# EAGLE design breakout (EAGLE 4.16)
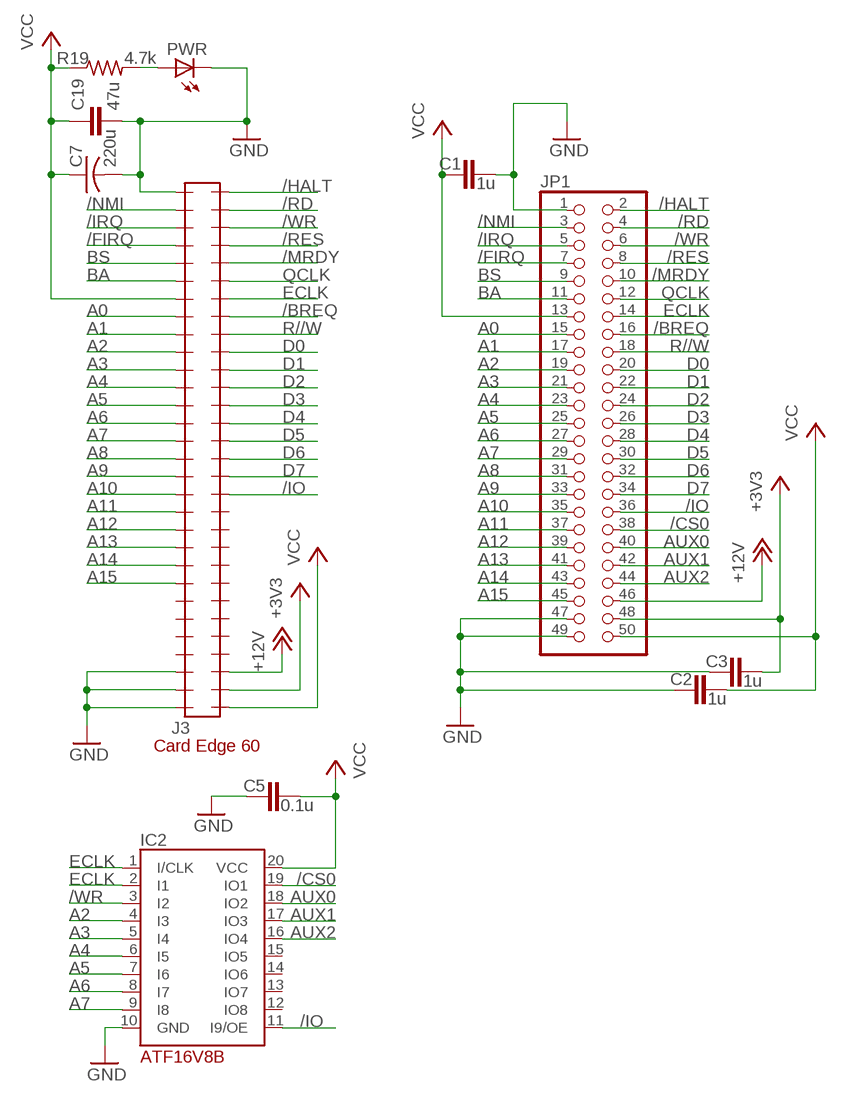
[diagram p0: schematic, sheet 1]

## Parts
C1  1u  C-EUC0603  [C0603]
C2  1u  C-EUC0603  [C0603]
C3  1u  C-EUC0603  [C0603]
C5  0.1u  C-EUC0603  [C0603]
C7  220u  C-US025-050X050  [C025-050X050]
C19  47u  C-EUC0805  [C0805]
IC2  PLD_ATF16V8B  [DIL20]
J3  CARDEDGE_2.54_60POSEDGE  [CARDEDGE_2.54_60POS]
JP1  PINHD-2X25  [2X25]
PWR  LED3MM  [LED3MM]
R19  4.7k  R-US_R0603  [R0603]

## Nets
+3V3 [supply]: C3.2 J3.32 JP1.48
+12V [supply]: J3.33 JP1.46
/BREQ: J3.53 JP1.16
/CS0: IC2.19(IO1) JP1.38
/FIRQ: J3.4 JP1.7
/HALT: J3.60 JP1.2
/IO: IC2.11(I9/OE) J3.43 JP1.36
/IRQ: J3.3 JP1.5
/MRDY: J3.56 JP1.10
/NMI: J3.2 JP1.3
/RD: J3.59 JP1.4
/RES: J3.57 JP1.8
/WR: IC2.3(I2) J3.58 JP1.6
A0: J3.8 JP1.15
A1: J3.9 JP1.17
A2: IC2.4(I3) J3.10 JP1.19
A3: IC2.5(I4) J3.11 JP1.21
A4: IC2.6(I5) J3.12 JP1.23
A5: IC2.7(I6) J3.13 JP1.25
A6: IC2.8(I7) J3.14 JP1.27
A7: IC2.9(I8) J3.15 JP1.29
A8: J3.16 JP1.31
A9: J3.17 JP1.33
A10: J3.18 JP1.35
A11: J3.19 JP1.37
A12: J3.20 JP1.39
A13: J3.21 JP1.41
A14: J3.22 JP1.43
A15: J3.23 JP1.45
AUX0: IC2.18(IO2) JP1.40
AUX1: IC2.17(IO3) JP1.42
AUX2: IC2.16(IO4) JP1.44
BA: J3.6 JP1.11
BS: J3.5 JP1.9
D0: J3.51 JP1.20
D1: J3.50 JP1.22
D2: J3.49 JP1.24
D3: J3.48 JP1.26
D4: J3.47 JP1.28
D5: J3.46 JP1.30
D6: J3.45 JP1.32
D7: J3.44 JP1.34
ECLK: IC2.1(I/CLK) IC2.2(I1) J3.54 JP1.14
GND: C1.2 C2.1 C3.1 C5.1 C7.2 C19.2 IC2.10(GND) J3.1 J3.28 J3.29 J3.30 JP1.1 JP1.47 JP1.49 PWR.K(C)
N$23: PWR.A R19.2
QCLK: J3.55 JP1.12
R//W: J3.52 JP1.18
VCC [supply]: C1.1 C2.2 C5.2 C7.1 C19.1 IC2.20(VCC) J3.7 J3.31 JP1.13 JP1.50 R19.1
Unconnected: IC2.12(IO8) IC2.13(IO7) IC2.14(IO6) IC2.15(IO5) J3.24 J3.25 J3.26 J3.27 J3.34 J3.35 J3.36 J3.37 J3.38 J3.39 J3.40 J3.41 J3.42

## Library data of the parts
C1-C3 C5 C19 = rcl:C-EU: CAPACITOR, European symbol
C7 = rcl:C-US: CAPACITOR, American symbol
IC2 = 07-Retrocomputing:PLD_ATF16V8B
J3 = 07-Retrocomputing:CARDEDGE_2.54_60POS
JP1 = pinhead:PINHD-2X25: PIN HEADER
PWR = led:LED: LED OSRAM: - CHIPLED LG R971, LG N971, LY N971, LG Q971, LY Q971, LO R971, LY R971 LH N974, LH R974 LS Q976, LO Q976, LY Q976 LO Q996 - Hyper CHIPLED LW Q18S LB Q993, LB Q99A, LB R99A - SideLED LS A670, LO A670, LY A670, LG A670, LP A670 LB A673, LV A673, LT A673, LW A673 LH A674 LY A675 LS A676, LA A676, LO A676, LY A676, LW A676 LS A679, LY A679, LG A679 - Hyper Micro SIDELED® LS Y876, LA Y876, LO Y876, LY Y876 LT Y87S - SmartLED LW L88C, LW L88S LB L89C, LB L89S, LG L890 LS L89K, LO L89K, LY L89K LS L896, LA L896, LO L896, LY L896 - TOPLED LS T670, LO T670, LY T670, LG T670, LP T670 LSG T670, LSP T670, LSY T670, LOP T670, LYG T670 LG T671, LOG T671, LSG T671 LB T673, LV T673, LT T673, LW T673 LH T674 LS T676, LA T676, LO T676, LY T676, LB T676, LH T676, LSB T676, LW T676 LB T67C, LV T67C, LT T67C, LS T67K, LO T67K, LY T67K, LW E67C LS E67B, LA E67B, LO E67B, LY E67B, LB E67C, LV E67C, LT E67C LW T67C LS T679, LY T679, LG T679 LS T770, LO T770, LY T770, LG T770, LP T770 LB T773, LV T773, LT T773, LW T773 LH T774 LS E675, LA E675, LY E675, LS T675 LS T776, LA T776, LO T776, LY T776, LB T776 LHGB T686 LT T68C, LB T68C - Hyper Mini TOPLED® LB M676 - Mini TOPLED Santana® LG M470 LS M47K, LO M47K, LY M47K Source: http://www.osram.convergy.de - LUMILED® LXK2-PW12-R00, LXK2-PW12-S00, LXK2-PW14-U00, LXK2-PW14-V00 LXK2-PM12-R00, LXK2-PM12-S00, LXK2-PM14-U00 LXK2-PE12-Q00, LXK2-PE12-R00, LXK2-PE12-S00, LXK2-PE14-T00, LXK2-PE14-U00 LXK2-PB12-K00, LXK2-PB12-L00, LXK2-PB12-M00, LXK2-PB14-N00, LXK2-PB14-P00, LXK2-PB14-Q00 LXK2-PR12-L00, LXK2-PR12-M00, LXK2-PR14-Q00, LXK2-PR14-R00 LXK2-PD12-Q00, LXK2-PD12-R00, LXK2-PD12-S00 LXK2-PH12-R00, LXK2-PH12-S00 LXK2-PL12-P00, LXK2-PL12-Q00, LXK2-PL12-R00 Source: www.luxeon.com
R19 = rcl:R-US_: RESISTOR, American symbol

## Net classes
0 default: width 0.203 mm, drill 0.203 mm, clearance 0.254 mm
1 supply: width 0.61 mm, drill 0.203 mm, clearance 0.305 mm
2 agnd: width 0.406 mm, drill 0.203 mm, clearance 0.305 mm

## Board
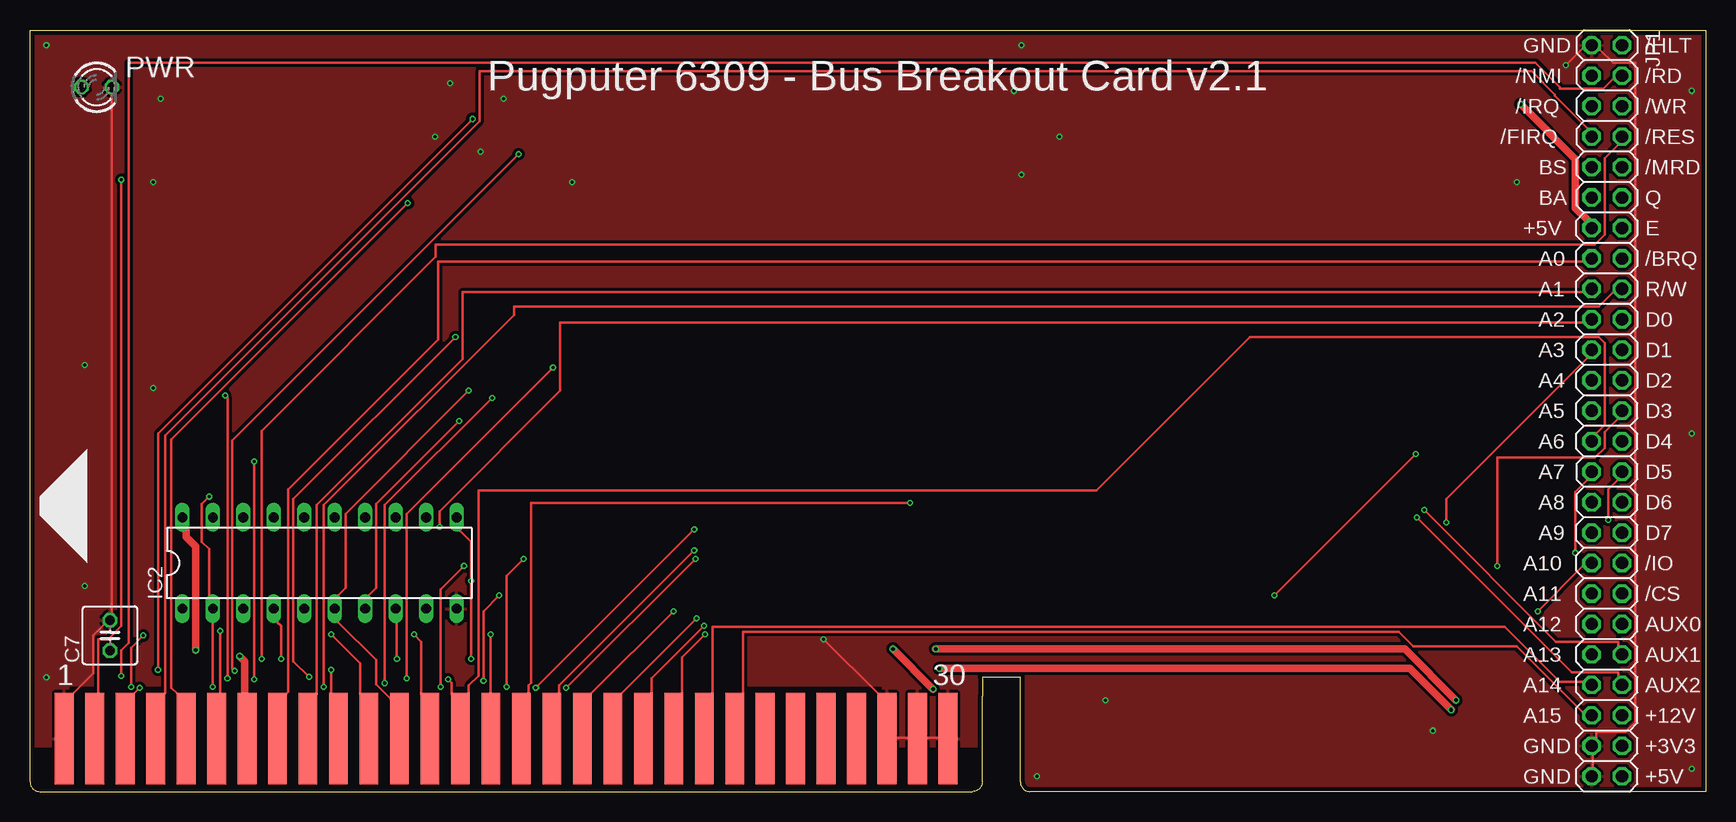
[diagram p1: board, top side]
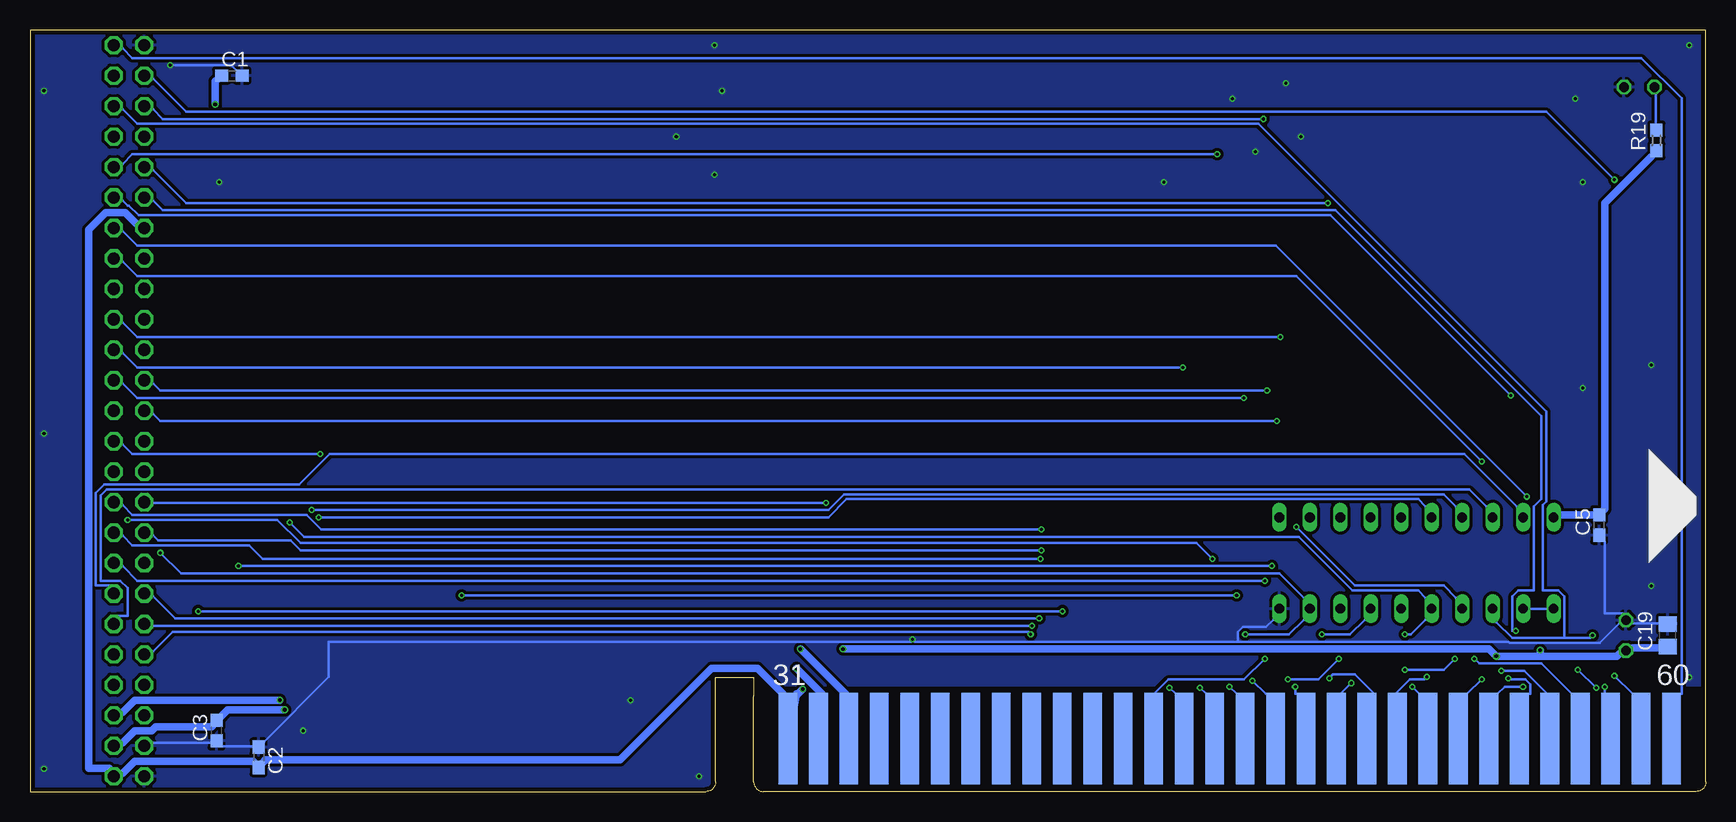
[diagram p2: board, bottom side, seen from below]

Size 139.7 x 63.5 mm. Coordinates in mm from the lower left corner, seen from the top.
Outline: 0,7.94 0,63.5 139.7,63.5 139.7,0 83.34,0 arc-90 82.55,0.79 82.55,9.53 79.38,9.53 79.38,7.94
Copper layers (1*16): Top 0.0356mm / dielectric 1.6mm / Bottom 0.0356mm
Design rules "oshpark-2layer": minimum track width 6mil, minimum drill 10mil, track to track 6mil, track to pad 6mil, pad to pad 6mil, via to via 6mil, smd to smd 6mil, copper to edge 15mil, drill to drill 6mil, minimum pad ring 5mil, minimum via ring 5mil, stop-mask expansion 2.5mil, vias tented up to drill 0mil, thermal gap 10mil

### Footprints (pad centres in the part's own frame; a part is rotated, then mirrored left to right if it is on the bottom)
C0603 = smd 1.1 x 1: 1 -0.85,0; 2 0.85,0
C025-050X050 = drill 0.813 octagon: 1 -1.27,0; 2 1.27,0
C0805 = smd 1.3 x 1.5: 1 -0.95,0; 2 0.95,0
DIL20 = drill 0.813 long: 1 -11.43,-3.81; 2 -8.89,-3.81; 3 -6.35,-3.81; 4 -3.81,-3.81; 5 -1.27,-3.81; 6 1.27,-3.81; 7 3.81,-3.81; 8 6.35,-3.81; 9 8.89,-3.81; 10 11.43,-3.81; 11 11.43,3.81; 12 8.89,3.81; 13 6.35,3.81; 14 3.81,3.81; 15 1.27,3.81; 16 -1.27,3.81; 17 -3.81,3.81; 18 -6.35,3.81; 19 -8.89,3.81; 20 -11.43,3.81
CARDEDGE_2.54_60POS = smd 1.556 x 7.62: 1 -36.83,4.41; 2 -34.29,4.41; 3 -31.75,4.41; 4 -29.21,4.41; 5 -26.67,4.41; 6 -24.13,4.41; 7 -21.59,4.41; 8 -19.05,4.41; 9 -16.51,4.41; 10 -13.97,4.41; 11 -11.43,4.41; 12 -8.89,4.41; 13 -6.35,4.41; 14 -3.81,4.41; 15 -1.27,4.41; 16 1.27,4.41; 17 3.81,4.41; 18 6.35,4.41; 19 8.89,4.41; 20 11.43,4.41; 21 13.97,4.41; 22 16.51,4.41; 23 19.05,4.41; 24 21.59,4.41; 25 24.13,4.41; 26 26.67,4.41; 27 29.21,4.41; 28 31.75,4.41; 29 34.29,4.41; 30 36.83,4.41 | smd 1.556 x 7.62 bottom: 31 36.83,4.41; 32 34.29,4.41; 33 31.75,4.41; 34 29.21,4.41; 35 26.67,4.41; 36 24.13,4.41; 37 21.59,4.41; 38 19.05,4.41; 39 16.51,4.41; 40 13.97,4.41; 41 11.43,4.41; 42 8.89,4.41; 43 6.35,4.41; 44 3.81,4.41; 45 1.27,4.41; 46 -1.27,4.41; 47 -3.81,4.41; 48 -6.35,4.41; 49 -8.89,4.41; 50 -11.43,4.41; 51 -13.97,4.41; 52 -16.51,4.41; 53 -19.05,4.41; 54 -21.59,4.41; 55 -24.13,4.41; 56 -26.67,4.41; 57 -29.21,4.41; 58 -31.75,4.41; 59 -34.29,4.41; 60 -36.83,4.41
2X25 = drill 1.016 octagon: 1 -30.48,-1.27; 2 -30.48,1.27; 3 -27.94,-1.27; 4 -27.94,1.27; 5 -25.4,-1.27; 6 -25.4,1.27; 7 -22.86,-1.27; 8 -22.86,1.27; 9 -20.32,-1.27; 10 -20.32,1.27; 11 -17.78,-1.27; 12 -17.78,1.27; 13 -15.24,-1.27; 14 -15.24,1.27; 15 -12.7,-1.27; 16 -12.7,1.27; 17 -10.16,-1.27; 18 -10.16,1.27; 19 -7.62,-1.27; 20 -7.62,1.27; 21 -5.08,-1.27; 22 -5.08,1.27; 23 -2.54,-1.27; 24 -2.54,1.27; 25 0,-1.27; 26 0,1.27; 27 2.54,-1.27; 28 2.54,1.27; 29 5.08,-1.27; 30 5.08,1.27; 31 7.62,-1.27; 32 7.62,1.27; 33 10.16,-1.27; 34 10.16,1.27; 35 12.7,-1.27; 36 12.7,1.27; 37 15.24,-1.27; 38 15.24,1.27; 39 17.78,-1.27; 40 17.78,1.27; 41 20.32,-1.27; 42 20.32,1.27; 43 22.86,-1.27; 44 22.86,1.27; 45 25.4,-1.27; 46 25.4,1.27; 47 27.94,-1.27; 48 27.94,1.27; 49 30.48,-1.27; 50 30.48,1.27
LED3MM = drill 0.813 octagon: A -1.27,0; K 1.27,0
R0603 = smd 1.1 x 1: 1 -0.85,0; 2 0.85,0

### Placement (x,y rotation side)
C1  122.87,59.69 0 bottom
C2  120.65,2.86 270 bottom
C3  124.14,5.08 90 bottom
C5  8.89,22.23 90 bottom
C7  6.67,13.02 90 top
C19  3.17,13.02 90 bottom
IC2  24.13,19.05 0 top
J3  39.69,0 0 top
JP1  131.44,31.75 270 top
PWR  5.56,58.74 0 top
R19  4.13,54.29 90 bottom

### Tracks (layer width: path | path; a pad name or v marks a point on that pad's centre or on a via)
+3V3  (via drill 0.3)
  Top 0.61: v118.47,6.81 115.01,10.26 v75.79,10.26
  Bottom 0.61: JP1.48 131.98,4.06 130.96,5.08 129.54,5.08 129.24,5.38 124.56,5.38 C3.2 123.65,6.4 123.24,6.81 v118.47,6.81 | v75.79,10.26 73.66,8.13 J3.32
+12V  (via drill 0.3)
  Top 0.61: v118.87,7.62 114.61,11.89 v75.49,11.89
  Bottom 0.61: v118.87,7.62 130.96,7.62 131.98,6.6 JP1.46 | v75.49,11.89 71.73,8.13 J3.33
/BREQ  (via drill 0.25)
  Top 0.203: v18.69,9.35 v18.69,27.53
  Bottom 0.203: v18.69,27.53 34.14,42.98 130.76,42.98 131.98,44.2 JP1.16 | v18.69,9.35 19.91,8.13 J3.53
/CS0
  Bottom 0.203: IC2.19 15.75,23.77 20.12,28.14 114.71,28.14 117.25,25.6 133.5,25.6 134.21,24.89 134.21,17.17 133.1,17.17 JP1.38
/FIRQ
  Top 0.203: JP1.7 129.84,55.27 127.1,58.01 127.1,58.12 125.17,60.05 37.49,60.05 37.49,55.88 11.28,29.67 11.28,8.23 11.18,8.13 J3.4
/HALT
  Bottom 0.203: JP1.2 131.98,61.98 131.17,61.16 5.38,61.16 2.03,57.81 2.03,8.13 2.13,8.13 J3.60
/IO  (via drill 0.25)
  Top 0.203: v36.78,11.07 v36.78,17.58 36.78,20.83 35.87,21.74 IC2.11
  Bottom 0.203: v36.78,11.07 38.51,9.35 44.81,9.35 46.02,8.13 J3.43 | v36.78,17.58 130.76,17.58 131.98,18.8 JP1.36
/IRQ  (via drill 0.25)
  Top 0.203: v36.88,56.08 10.67,29.87 v10.67,10.16 | v9.14,8.64 8.64,8.13 J3.3
  Bottom 0.203: v36.88,56.08 128.63,56.08 129.44,56.9 JP1.5 | v9.14,8.64 v10.67,10.16
/MRDY  (via drill 0.25)
  Top 0.203: v40.74,53.14 16.87,29.26 16.87,10.26 v17.07,10.06
  Bottom 0.203: v40.74,53.14 131.17,53.14 131.98,52.32 JP1.10 | v17.07,10.06 15.14,10.06 13.21,8.13 J3.56
/NMI  (via drill 0.25)
  Top 0.203: v7.62,51 7.62,13.82 6.5,12.7 5.69,12.7 5.69,8.13 J3.2
  Bottom 0.203: v7.62,51 13.31,56.69 126.69,56.69 129.44,59.44 JP1.3
/RD  (via drill 0.25)
  Top 0.203: v7.62,9.65 7.62,11.79 8.23,12.39 8.23,60.76 125.48,60.76 127.51,58.73 127.51,58.62 131.17,58.62 131.98,59.44 JP1.4
  Bottom 0.203: v7.62,9.65 6.1,8.13 J3.59
/RES  (via drill 0.25)
  Top 0.203: v19.3,11.07 19.3,30.07 33.83,44.6 33.83,45.62 130.45,45.62 131.27,46.43 131.27,52.83 132.38,53.95 JP1.8
  Bottom 0.203: v19.3,11.07 18.9,10.67 13.72,10.67 11.18,8.13 J3.57
/WR  (via drill 0.25)
  Top 0.203: v9.45,13.01 8.43,11.99 v8.43,8.74
  Bottom 0.203: 11.79,12.8 9.65,12.8 v9.45,13.01 | 11.79,12.8 16.15,12.8 17.48,14.12 IC2.3 | v8.43,8.74 8.43,8.13 J3.58 | 11.79,12.8 11.79,16.26 12.29,16.76 13.61,16.76 13.61,23.88 13.31,24.18 13.31,31.7 37.29,55.68 130.76,55.68 131.98,56.9 JP1.6
A0
  Top 0.203: JP1.15 129.44,44.2 34.04,44.2 34.04,37.69 21.54,25.2 21.54,8.33 21.34,8.13 J3.8
A1
  Top 0.203: JP1.17 129.44,41.66 36.07,41.66 36.07,36.07 23.88,23.88 23.88,8.13 J3.9
A2  (via drill 0.25)
  Top 0.203: v20.93,11.07 20.93,13.82 20.62,14.12 IC2.4 | v25.09,10.16 25.09,8.13 J3.10 | v34.14,22.05 34.14,23.37 44.2,33.43 44.2,39.12 129.44,39.12 JP1.19
  Bottom 0.203: v20.93,11.07 21.84,10.16 v25.09,10.16 | v34.14,22.05 29.26,17.17 21.84,17.17 20.83,16.15 IC2.4
A3  (via drill 0.25)
  Top 0.203: v25.09,13.11 27.53,10.67 27.53,8.13 J3.11 | v118.06,22.45 118.06,24.38 129.84,36.17 JP1.21
  Bottom 0.203: v25.09,13.11 24.59,13.11 23.37,14.33 IC2.5 23.37,16.15 23.98,16.76 29.46,16.76 33.93,21.23 116.84,21.23 v118.06,22.45
A4  (via drill 0.25)
  Top 0.203: J3.12 30.07,7.72 28.85,8.94 28.85,10.97 25.7,14.12 IC2.6 25.7,16.36 26.31,16.97 26.31,23.16 v36.58,33.43
  Bottom 0.203: v36.58,33.43 128.83,33.43 129.44,34.04 JP1.23
A5  (via drill 0.25)
  Top 0.203: v32,13.11 32.61,12.5 32.61,8.13 J3.13 | v35.76,30.89 28.85,23.98 28.85,16.97 28.25,16.36 IC2.7
  Bottom 0.203: v32,13.11 29.67,13.11 28.45,14.33 IC2.7 | v35.76,30.89 128.83,30.89 129.44,31.5 JP1.25
A6  (via drill 0.25)
  Top 0.203: v30.58,11.07 30.58,14.12 IC2.8 | v34.85,9.35 35.15,9.04 35.15,8.13 J3.14 36.58,8.13 36.58,8.84 37.39,9.65 37.39,25.09 88.9,25.09 101.7,37.9 130.76,37.9 131.27,37.39 131.27,30.58 130.56,29.87 JP1.27
  Bottom 0.203: v30.58,11.07 32.31,9.35 v34.85,9.35
A7  (via drill 0.25)
  Top 0.203: v38.41,13.11 38.41,8.13 J3.15 | v128.83,19.91 128.83,24.99 129.84,26.01 JP1.29
  Bottom 0.203: v38.41,13.11 34.75,13.11 33.53,14.33 IC2.9 33.53,16.15 35.56,18.19 127.1,18.19 v128.83,19.91
A8  (via drill 0.25)
  Top 0.203: v73.36,24.08 41.76,24.08 41.76,9.04 41.55,8.84 41.55,8.13 J3.16
  Bottom 0.203: v73.36,24.08 129.44,24.08 JP1.31
A9  (via drill 0.25)
  Top 0.203: v55.37,20.12 44.09,8.84 44.09,8.13 J3.17
  Bottom 0.203: v55.37,20.12 117.14,20.12 117.96,20.93 129.03,20.93 129.44,21.34 JP1.33
A10  (via drill 0.25)
  Top 0.203: v125.68,15.04 129.44,18.8 JP1.35 | v53.65,15.04 46.74,8.13 J3.18
  Bottom 0.203: v53.65,15.04 v125.68,15.04
A11  (via drill 0.25)
  Top 0.203: v55.58,14.43 49.28,8.13 J3.19
  Bottom 0.203: v55.58,14.43 127.61,14.43 129.44,16.26 JP1.37
A12  (via drill 0.25)
  Top 0.203: v56.19,13.82 51.82,9.45 51.82,8.13 J3.20
  Bottom 0.203: v56.19,13.82 129.44,13.82 JP1.39
A13  (via drill 0.25)
  Top 0.203: v56.29,13.11 54.36,11.18 54.36,8.13 J3.21
  Bottom 0.203: v56.29,13.11 56.49,13.31 127.81,13.31 129.44,11.68 JP1.41
A14
  Top 0.203: JP1.43 129.44,9.14 127.51,9.14 122.94,13.72 56.9,13.72 56.9,8.13 J3.22
A15
  Top 0.203: JP1.45 129.44,6.6 123.95,12.09 115.32,12.09 114.1,13.31 59.44,13.31 59.44,8.13 J3.23
AUX0
  Bottom 0.203: IC2.18 18.29,23.77 19.71,25.2 133.3,25.2 133.81,24.69 133.81,17.58 132.18,17.58 131.57,16.97 131.57,14.63 132.38,14.63 JP1.40
AUX1  (via drill 0.25)
  Top 0.203: v116.23,23.47 127.2,12.5 132.38,12.5 132.38,12.09 JP1.42
  Bottom 0.203: v116.23,23.47 73.15,23.47 71.83,24.79 21.84,24.79 20.83,23.77 IC2.17
AUX2  (via drill 0.25)
  Top 0.203: v115.62,22.86 128.52,9.96 132.38,9.96 132.38,9.55 JP1.44
  Bottom 0.203: v115.62,22.86 73.15,22.86 71.63,24.38 23.98,24.38 23.37,23.77 IC2.16
BA  (via drill 0.25)
  Top 0.203: v15.85,13.41 15.85,8.13 J3.6
  Bottom 0.203: v15.85,13.41 16.15,13.41 16.15,16.26 15.65,16.76 14.33,16.76 14.33,23.77 13.72,24.38 13.72,31.29 30.89,48.46 128.63,48.46 129.44,49.28 JP1.11
BS  (via drill 0.25)
  Top 0.203: v31.5,49.07 11.79,29.36 11.79,8.64 12.29,8.13 J3.5
  Bottom 0.203: v31.5,49.07 126.69,49.07 129.44,51.82 JP1.9
D0  (via drill 0.25)
  Top 0.203: v35.46,37.9 21.95,24.38 21.95,10.87 v23.27,9.55
  Bottom 0.203: v35.46,37.9 130.76,37.9 131.98,39.12 JP1.20 | v23.27,9.55 23.47,9.35 24.69,9.35 25.91,8.13 J3.51
D1  (via drill 0.25)
  Top 0.203: v43.59,35.36 31.39,23.16 v31.39,9.45
  Bottom 0.203: v43.59,35.36 130.76,35.36 131.98,36.58 JP1.22 | v31.39,9.45 31.09,9.75 29.26,9.75 27.64,8.13 J3.50
D2  (via drill 0.25)
  Top 0.203: v38.51,32.82 29.57,23.88 v29.57,9.04
  Bottom 0.203: v38.51,32.82 130.76,32.82 131.98,34.04 JP1.24 | v29.57,9.04 30.48,8.13 J3.49
D3  (via drill 0.25)
  Top 0.203: v122.33,18.8 122.33,27.84 130.45,27.84 131.27,28.65 131.27,29.97 132.38,31.09 JP1.26 | v36.17,18.8 34.24,16.87 v34.24,8.74
  Bottom 0.203: v36.17,18.8 v122.33,18.8 | v34.24,8.74 34.24,8.13 34.04,8.13 J3.48
D4  (via drill 0.25)
  Top 0.203: v103.73,16.36 v115.52,28.14 | v39.12,16.36 37.8,15.04 v37.8,9.25
  Bottom 0.203: v115.52,28.14 131.17,28.14 131.98,28.96 JP1.28 | v39.12,16.36 v103.73,16.36 | v37.8,9.25 36.68,8.13 36.58,8.13 J3.47
D5  (via drill 0.25)
  Top 0.203: v131.57,22.66 131.57,25.2 132.38,26.01 JP1.30 | v41.15,19.41 39.73,17.98 v39.73,8.74
  Bottom 0.203: v131.57,22.66 119.08,22.66 117.14,20.73 42.47,20.73 v41.15,19.41 | v39.73,8.74 39.12,8.13 J3.46
D6  (via drill 0.25)
  Top 0.203: v42.16,8.64 v55.37,21.84
  Bottom 0.203: v55.37,21.84 115.42,21.84 116.64,23.06 131.17,23.06 131.98,23.88 JP1.32 | v42.16,8.64 41.66,8.13 J3.45
D7  (via drill 0.25)
  Top 0.203: v44.7,8.64 v55.47,19.41
  Bottom 0.203: v55.47,19.41 120.29,19.41 121.41,20.52 131.17,20.52 131.98,21.34 JP1.34 | v44.7,8.64 44.2,8.13 J3.44
ECLK  (via drill 0.25)
  Top 0.203: v14.94,24.59 14.33,23.98 14.33,20.83 14.94,20.22 14.94,16.36 IC2.2 v15.24,8.74
  Bottom 0.203: IC2.2 IC2.1 | v14.94,24.59 35.87,45.52 130.76,45.52 131.98,46.74 JP1.14 | v15.24,8.74 16.76,8.74 17.37,8.13 J3.54
GND  (via drill 0.25)
  Top 0.203: v128.02,60.55 129.44,61.98 JP1.1 130.86,61.87 131.98,60.76 133.81,60.76 133.81,5.79 132.99,4.98 130.56,4.98 130.56,4.47 JP1.47 130.25,3.15 130.25,1.93 JP1.49 | J3.30 75.79,4.47 74.68,4.47 J3.29 73.25,4.47 72.14,4.47 J3.28 70.71,8.13 v66.14,12.7 | PWR.K 6.81,58.22 6.81,14.83 C7.2 6.2,13.92 5.28,13.01 5.28,9.86 3.56,8.13 J3.1
  Bottom 0.203: v128.02,60.55 122.94,60.55 122.53,60.15 C1.2 | JP1.47 129.44,4.06 124.56,4.06 C3.1 123.65,3.76 121.11,3.76 C2.1 120.19,4.17 114.81,9.55 114.81,12.5 66.24,12.5 v66.14,12.7 65.94,12.5 39.01,12.5 | C5.1 8.43,20.83 8.43,14.83 6.91,14.83 C7.2 | C19.2 3.86,14.02 6.1,14.02 C7.2 | 39.01,12.5 39.01,13.31 38.61,13.72 36.68,13.72 36.07,14.33 IC2.10 | 39.01,12.5 16.46,12.5 16.36,12.39 8.84,12.39 7.21,14.02 C7.2
  other vias: 83.92,1.27 1.37,62.23 4.55,17.14 1.37,9.53 82.65,62.23 82.02,58.42 85.83,54.61 82.65,51.44 89.64,7.62 4.55,35.56 10.9,57.78 37.57,53.34 45.19,50.8 116.94,5.08 138.53,29.84 138.53,1.91 123.93,50.8 138.53,58.42 35.03,59.05 39.47,57.78 33.76,54.61 10.26,50.8 10.26,33.66
  pour Bottom: 0,63.5 139.7,63.5 139.7,0 82.55,0 82.55,8.89 0,8.89
  pour Top: 0,63.5 0,3.81 2.54,3.81 3.17,3.81 3.17,8.89 71.12,8.89 71.12,3.81 82.55,3.81 82.55,0 139.7,0 139.7,63.5
N$23
  Bottom 0.203: R19.2 4.17,55.68 4.17,58.22 PWR.A
QCLK  (via drill 0.25)
  Top 0.203: v16.26,33.02 16.46,32.82 v16.46,9.45
  Bottom 0.203: v16.26,33.02 31.29,48.06 130.66,48.06 131.47,48.87 131.57,48.87 131.98,49.28 JP1.12 | v16.46,9.45 16.36,9.35 15.04,9.35 14.63,8.94 14.63,8.13 14.83,8.13 J3.55
R//W  (via drill 0.25)
  Top 0.203: v24.49,8.74 24.49,23.88 40.34,39.73 40.34,40.44 130.76,40.44 131.98,41.66 JP1.18
  Bottom 0.203: v24.49,8.74 23.88,8.13 J3.52
VCC  (via drill 0.3)
  Top 0.61: v17.48,11.28 17.88,10.87 17.88,8.13 J3.7 | v13.82,11.79 13.82,20.42 13.01,21.23 13.01,21.74 IC2.20 | v124.26,57.3 128.83,52.73 128.83,48.67 129.84,47.65 JP1.13 | v71.93,11.89 v75.29,8.53
  Bottom 0.61: C19.1 3.86,11.99 6.1,11.99 C7.1 7.21,11.48 7.42,11.28 13.82,11.28 | 13.82,11.28 v17.48,11.28 18.09,11.89 v71.93,11.89 | IC2.20 12.19,23.06 9.35,23.06 C5.2 8.43,23.57 8.43,49.07 4.57,52.93 R19.1 | 13.82,11.28 v13.82,11.79 | v124.26,57.3 124.26,59.23 C1.1 | JP1.13 130.86,47.35 131.78,48.26 133.4,48.26 134.82,46.84 134.82,1.93 133.1,1.93 JP1.50 131.98,1.52 130.96,2.54 121.11,2.54 C2.2 120.19,2.54 120.09,2.64 90.53,2.64 82.91,10.26 79.05,10.26 76.91,8.13 J3.31 75.79,8.13 75.69,8.13 v75.29,8.53

### Text on the board
tPlace: GND | /HLT | /NMI | /RD | Pugputer 6309 - Bus Breakout Card v2.1 | /IRQ | /WR | /FIRQ | /RES | BS | /MRD | BA | Q | +5V | E | A0 | /BRQ | A1 | R/W | A2 | D0 | A3 | D1 | A4 | D2 | A5 | D3 | A6 | D4 | A7 | D5 | A8 | D6 | A9 | D7 | A10 | /IO | A11 | /CS | A12 | AUX0 | A13 | AUX1 | A14 | AUX2 | A15 | +12V | GND | +3V3 | GND | +5V